# EasyEDA Pro project TPS54331_Neko_BEC.eprj

# Schematic TPS54331_EVA_Board
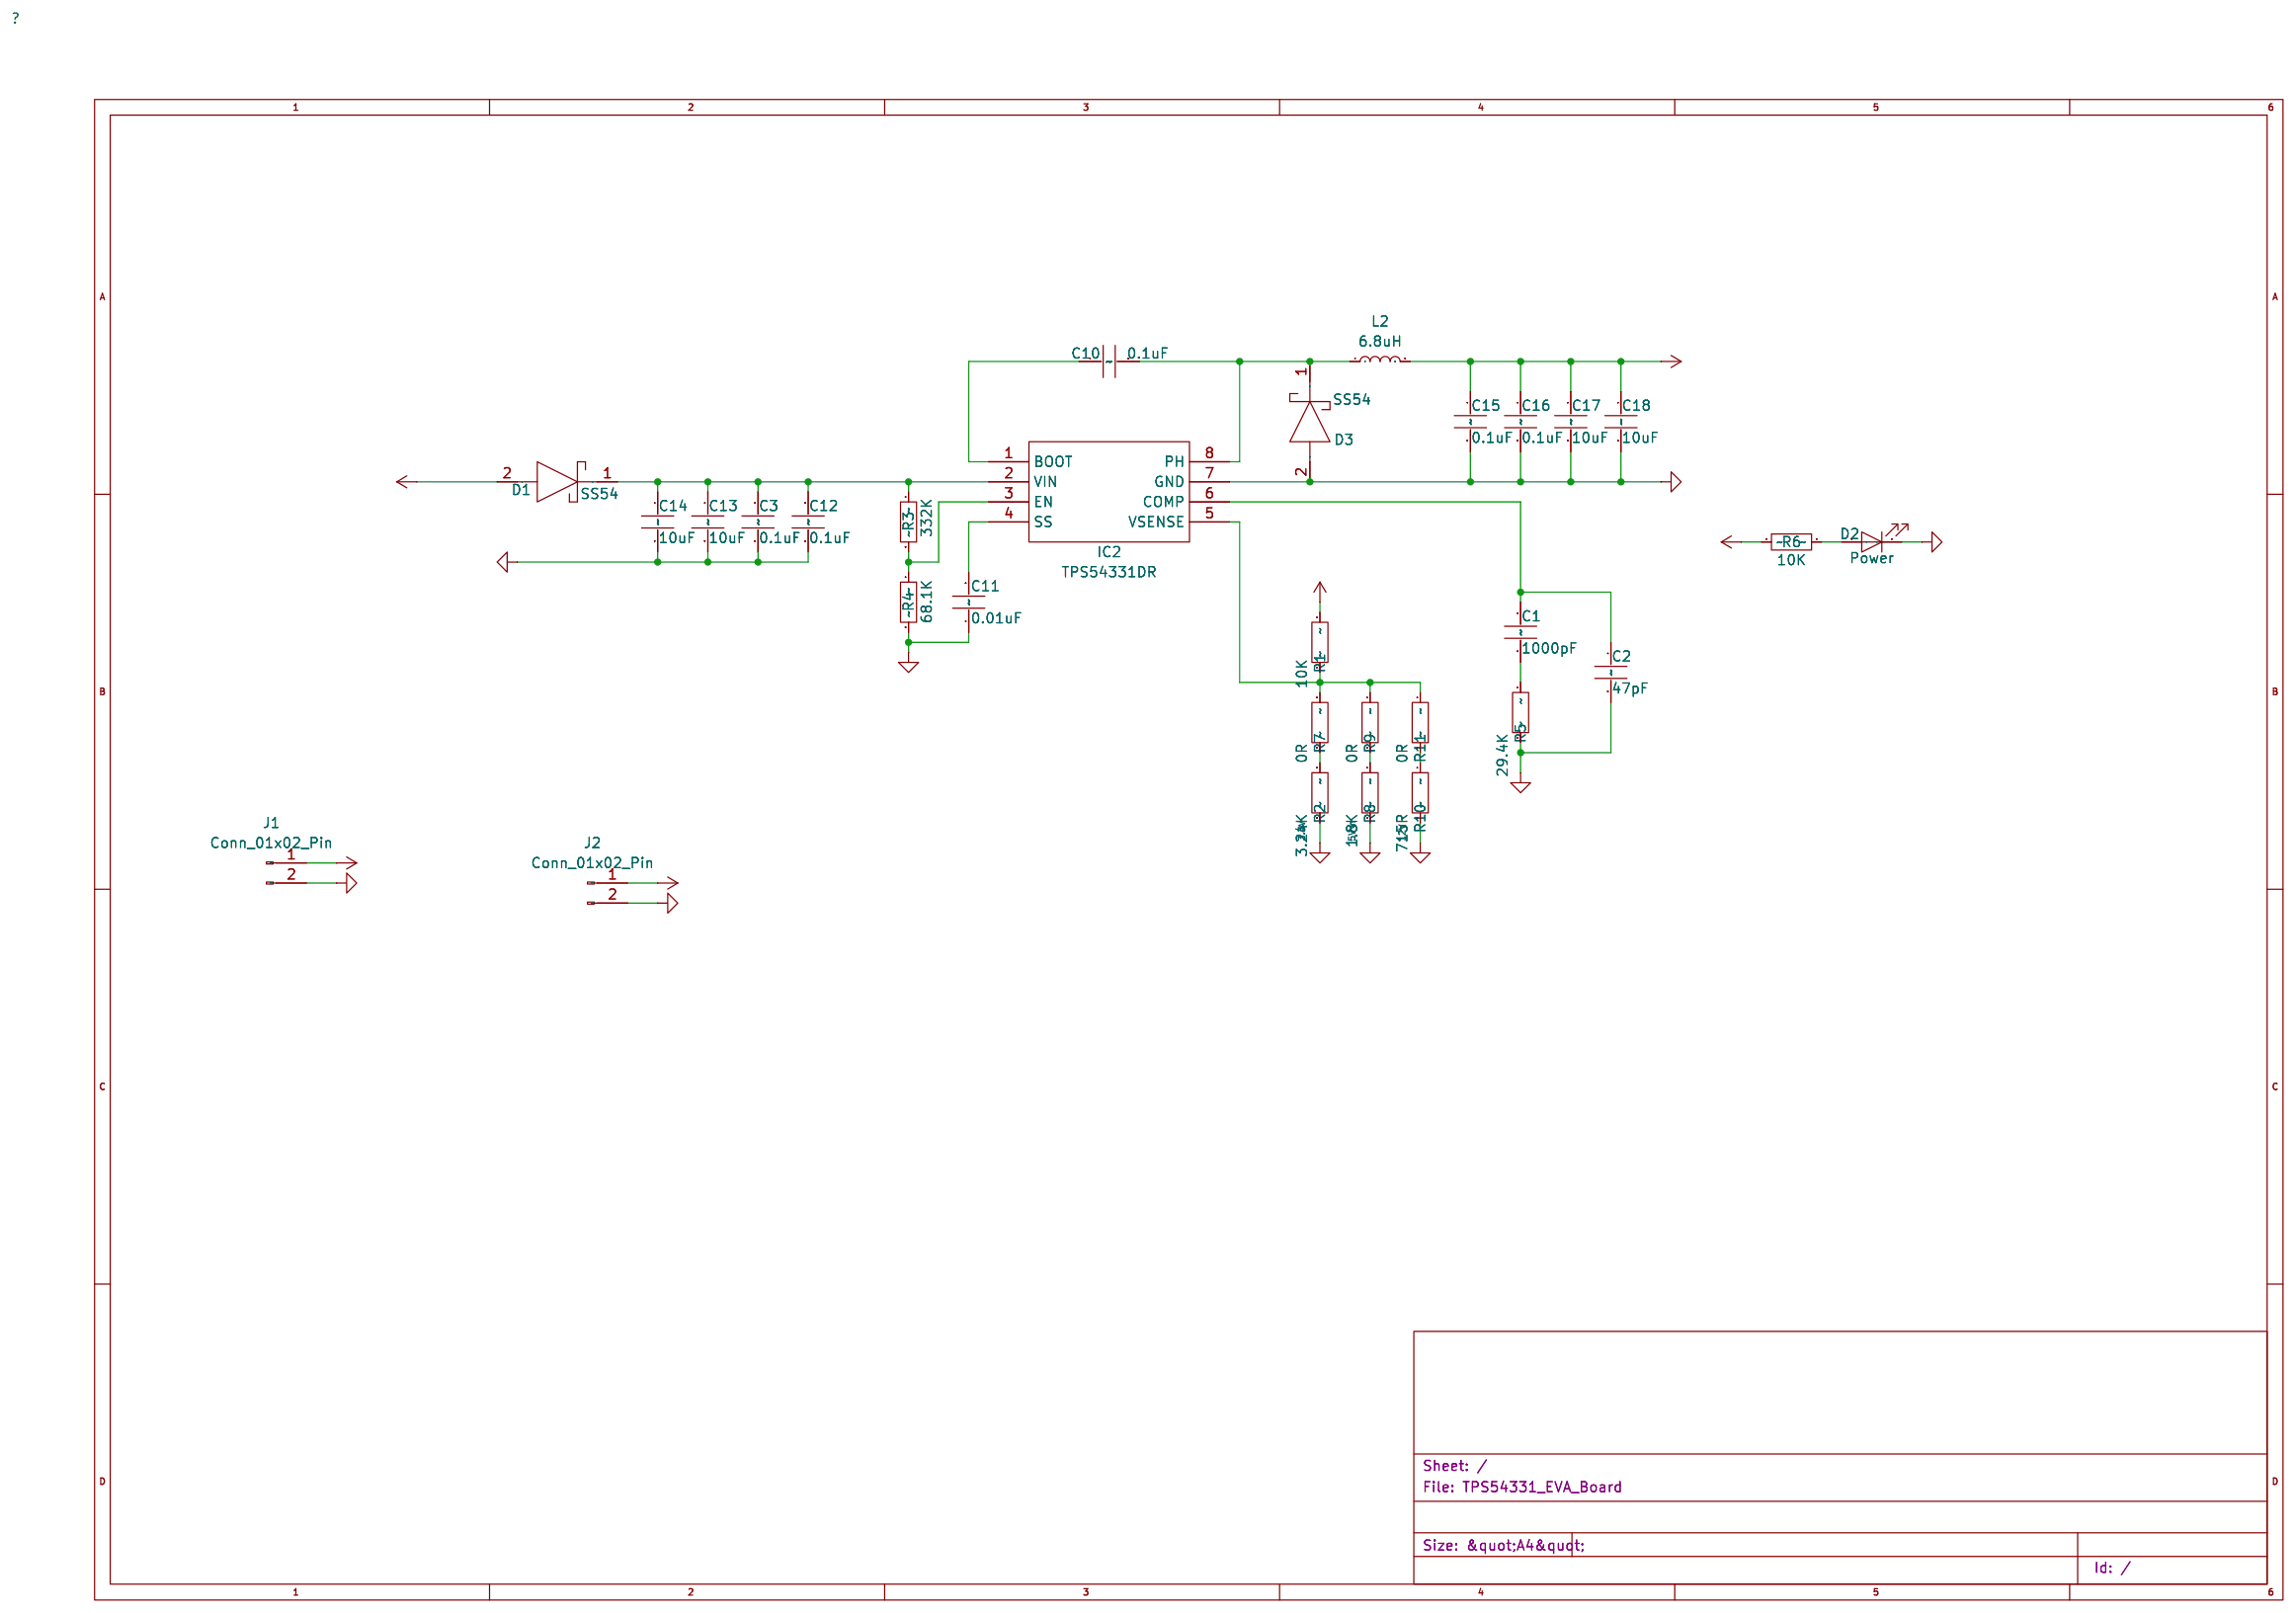
[diagram p0: schematic sheet]

## Parts
C1  1000pF  [Capacitor_SMD:C_0603_1608Metric]
C2  47pF  [Capacitor_SMD:C_0603_1608Metric]
C3  0.1uF  [Capacitor_SMD:C_1206_3216Metric]
C10  0.1uF  [Capacitor_SMD:C_0603_1608Metric]
C11  0.01uF  [Capacitor_SMD:C_0603_1608Metric]
C12  0.1uF  [Capacitor_SMD:C_1206_3216Metric]
C13  10uF  [Capacitor_SMD:C_1206_3216Metric]
C14  10uF  [Capacitor_SMD:C_1206_3216Metric]
C15  0.1uF  [Capacitor_SMD:C_1206_3216Metric]
C16  0.1uF  [Capacitor_SMD:C_1206_3216Metric]
C17  10uF  [Capacitor_SMD:C_1206_3216Metric]
C18  10uF  [Capacitor_SMD:C_1206_3216Metric]
D1  SS54  [SamacSys_Parts:DIOM5126X245N]
D2  Power  [LED_SMD:LED_0603_1608Metric]
D3  SS54  [SamacSys_Parts:DIOM5126X245N]
IC2  TPS54331DR  [SamacSys_Parts:SOIC127P600X175-8N]
J1  Conn_01x02_Pin  [SamacSys_Parts:Power_PAD]
J2  Conn_01x02_Pin  [SamacSys_Parts:Power_PAD]
L2  6.8uH  [Inductor_SMD:L_Changjiang_FNR5040S]
R1  10K  [Resistor_SMD:R_0603_1608Metric]
R2  3.24K  [Resistor_SMD:R_0603_1608Metric]
R3  332K  [Resistor_SMD:R_0603_1608Metric]
R4  68.1K  [Resistor_SMD:R_0603_1608Metric]
R5  29.4K  [Resistor_SMD:R_0603_1608Metric]
R6  10K  [Resistor_SMD:R_0603_1608Metric]
R7  0R  [Resistor_SMD:R_0603_1608Metric]
R8  1.8K  [Resistor_SMD:R_0603_1608Metric]
R9  0R  [Resistor_SMD:R_0603_1608Metric]
R10  715R  [Resistor_SMD:R_0603_1608Metric]
R11  0R  [Resistor_SMD:R_0603_1608Metric]

## Library data of the parts
C1-C3 C10-C18 = Device_C: Unpolarized capacitor
D1 D3 = SamacSys_Parts_SS54: 40V 550mV@5A 5A SMA(DO-214AC) Schottky Barrier Diodes (SBD); User doc link: https://datasheet.lcsc.com/lcsc/2111080930_LGE-SS54_C2903855.pdf; Height: 2.45; Manufacturer_Name: LGE
D2 = Device_LED: Light emitting diode
IC2 = SamacSys_Parts_TPS54331DR: Texas Instruments TPS54331DR, Step Down DC-DC Converter, 3A, Adjustable, 0.8  25 V, 8-Pin SOIC; User doc link: http://www.ti.com/lit/gpn/tps54331; Height: 1.75; Manufacturer_Name: Texas Instruments; Mouser Part Number: 595-TPS54331DR; Mouser Price/Stock: https://www.mouser.co.uk/ProductDetail/Texas-Instruments/TPS54331DR?qs=QyYHynRG50rsSYcB%2Ftz4Yw%3D%3D; Arrow Price/Stock: https://www.arrow.com/en/products/tps54331dr/texas-instruments?region=nac
J1 J2 = Connector_Conn_01x02_Pin: Generic connector, single row, 01x02, script generated
L2 = Device_L: Inductor
R1-R11 = Device_R: Resistor

## Nets
POWER_+5V: C15.1 C16.1 C17.1 C18.1 J2.1(Pin) L2.2 R1.1 R6.1
POWER_GND: C2.2 C3.2 C11.1 C12.2 C13.2 C14.2 C15.2 C16.2 C17.2 C18.2 D2.1(K) D3.2(A) IC2.7(GND) J1.2(Pin) J2.2(Pin) R2.2 R4.2 R5.2 R8.2 R10.2
POWER_VCC: D1.2(A) J1.1(Pin)
NET-(C1-PAD2): C1.2 R5.1
NET-(D1-K): C3.1 C12.1 C13.1 C14.1 D1.1(K) IC2.2(VIN) R3.1
NET-(D2-A): D2.2(A) R6.2
NET-(D3-K): C10.2 D3.1(K) IC2.8(PH) L2.1
NET-(IC2-BOOT): C10.1 IC2.1(BOOT)
NET-(IC2-COMP): C1.1 C2.1 IC2.6(COMP)
NET-(IC2-EN): IC2.3(EN) R3.2 R4.1
NET-(IC2-SS): C11.2 IC2.4(SS)
NET-(IC2-VSENSE): IC2.5(VSENSE) R1.2 R7.1 R9.1 R11.1
NET-(R2-PAD1): R2.1 R7.2
NET-(R8-PAD1): R8.1 R9.2
NET-(R10-PAD1): R10.1 R11.2

## Notes on the sheet
- 3.3V
- 5V\n
- 12V

# Board TPS54331_EVA_Board
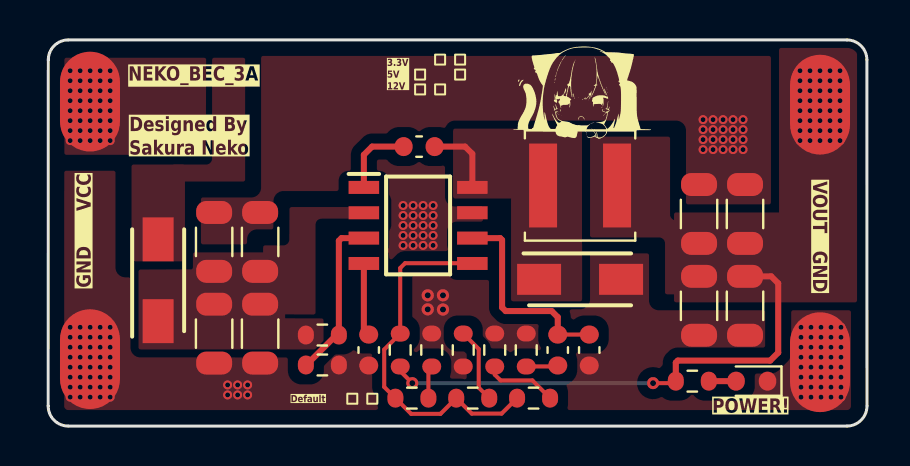
[diagram p1: board, top side]
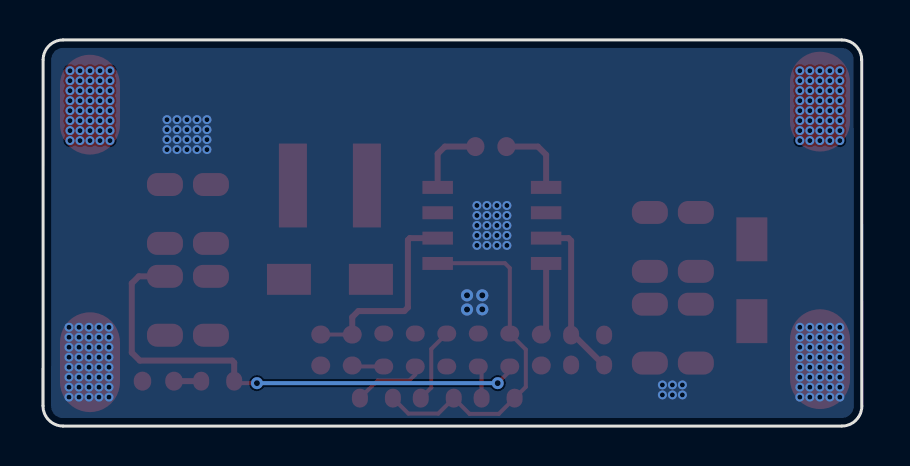
[diagram p2: board, bottom side, seen from below]

Outline 40.95 x 19.34 mm; copper layers: Top Layer, Bottom Layer. Coordinates in mm from the lower left corner of the outline.
Outline path: 0,1.01 0.01,18.34 arc(0.3,19.05) 1.01,19.34 39.94,19.34 arc(40.65,19.05) 40.94,18.34 40.95,1.01 arc(40.65,0.3) 39.94,0 1.01,0 arc(0.29,0.3) 0,1.01
Stack: Top Layer 0.035mm / Dielectric1 1.51mm FR4 er 4.5 / Bottom Layer 0.035mm

## Design rules (mm)
template: 用户自定义配置
spacing safeClearance (default): track to track 0, other pairs 0 to 0.5
track width trackWidth (default): min 0.127, default 0.254, max 2.54
differential pair differentialPair (default): width min 0.127, default 0.254, max 2.54; gap min 0.152, default 0.152
via viaSize (default): diameter min 0.5, default 0.61, max 10; hole min 0.3, default 0.305, max 5.999
net +5V uses CopperRegion4
net Net-(D1-K) uses CopperRegion2
net VCC uses CopperRegion8
net Net-(D3-K) uses CopperRegion6
net GND uses CopperRegion10
pour ie586 uses CopperRegion9
pour ie587 uses CopperRegion9
pour ie588 uses CopperRegion9
pour ie589 uses CopperRegion9
pour ie590 uses CopperRegion9
pour ie591 uses CopperRegion9
pour ie592 uses CopperRegion9
pour ie593 uses CopperRegion9
pour ie595 uses CopperRegion9

## Placement (name value [footprint] x y rotation side)
C1  1000pF  [Capacitor_SMD:C_0603_1608Metric]  25.48 3.81 270 top
C2  47pF  [Capacitor_SMD:C_0603_1608Metric]  27.06 3.81 270 top
C3  0.1uF  [Capacitor_SMD:C_1206_3216Metric]  10.6 9.22 90 top
C10  0.1uF  [Capacitor_SMD:C_0603_1608Metric]  18.55 14 0 top
C11  0.01uF  [Capacitor_SMD:C_0603_1608Metric]  16.03 3.81 90 top
C12  0.1uF  [Capacitor_SMD:C_1206_3216Metric]  10.6 4.63 270 top
C13  10uF  [Capacitor_SMD:C_1206_3216Metric]  8.3 9.22 90 top
C14  10uF  [Capacitor_SMD:C_1206_3216Metric]  8.3 4.63 270 top
C15  0.1uF  [Capacitor_SMD:C_1206_3216Metric]  32.55 6.02 270 top
C16  0.1uF  [Capacitor_SMD:C_1206_3216Metric]  32.55 10.62 90 top
C17  10uF  [Capacitor_SMD:C_1206_3216Metric]  34.85 6.02 270 top
C18  10uF  [Capacitor_SMD:C_1206_3216Metric]  34.85 10.62 90 top
D1  SS54  [SamacSys_Parts:DIOM5126X245N]  5.5 7.3 90 top
D2  Power  [LED_SMD:LED_0603_1608Metric]  35.19 2.25 180 top
D3  SS54  [SamacSys_Parts:DIOM5126X245N]  26.6 7.35 0 top
G***  LOGO  [SamacSys_Parts:nya]  26.71 16.81 0 top
IC2  TPS54331DR  [SamacSys_Parts:SOIC127P600X175-8N]  18.5 10.05 0 top
J1  Conn_01x02_Pin  [SamacSys_Parts:Power_PAD]  2.09 9.85 270 top
J2  Conn_01x02_Pin  [SamacSys_Parts:Power_PAD]  38.6 9.7 270 top
L2  6.8uH  [Inductor_SMD:L_Changjiang_FNR5040S]  26.6 12.05 0 top
R1  10K  [Resistor_SMD:R_0603_1608Metric]  17.61 3.81 90 top
R2  3.24K  [Resistor_SMD:R_0603_1608Metric]  19.18 3.81 90 top
R3  332K  [Resistor_SMD:R_0603_1608Metric]  13.71 4.56 0 top
R4  68.1K  [Resistor_SMD:R_0603_1608Metric]  13.71 3.06 0 top
R5  29.4K  [Resistor_SMD:R_0603_1608Metric]  23.91 3.81 90 top
R6  10K  [Resistor_SMD:R_0603_1608Metric]  32.21 2.25 0 top
R7  0R  [Resistor_SMD:R_0603_1608Metric]  18.19 1.4 0 top
R8  1.8K  [Resistor_SMD:R_0603_1608Metric]  20.76 3.81 270 top
R9  0R  [Resistor_SMD:R_0603_1608Metric]  21.23 1.4 0 top
R10  715R  [Resistor_SMD:R_0603_1608Metric]  22.33 3.81 90 top
R11  0R  [Resistor_SMD:R_0603_1608Metric]  24.28 1.4 0 top

## Footprints (pads in the part's own frame, mm; a bottom-side part is the same pattern mirrored in y, then rotated)
Capacitor_SMD:C_0603_1608Metric
  rrect 0.9x0.95 smd: 1(-0.775,0) 2(0.775,0)
Capacitor_SMD:C_1206_3216Metric
  rrect 1.15x1.8 smd: 1(-1.475,0) 2(1.475,0)
Inductor_SMD:L_Changjiang_FNR5040S
  rect 1.4x4.2 smd: 1(-1.85,0) 2(1.85,0)
LED_SMD:LED_0603_1608Metric
  rrect 0.875x0.95 smd: 1(-0.787,0) 2(0.787,0)
Resistor_SMD:R_0603_1608Metric
  rrect 0.8x0.95 smd: 1(-0.825,0) 2(0.825,0)
SamacSys_Parts:DIOM5126X245N
  rect 2.2x1.55 smd: 1(-2.05,0) 2(2.05,0)
SamacSys_Parts:Power_PAD
  rrect 5x3 smd: 1(-6.4,0) 2(6.5,0)
SamacSys_Parts:SOIC127P600X175-8N
  rect 1.525x0.65 smd: 1(-2.712,1.905) 2(-2.712,0.635) 3(-2.712,-0.635) 4(-2.712,-1.905) 5(2.712,-1.905) 6(2.712,-0.635) 7(2.712,0.635) 8(2.712,1.905)

## Nets
As in the schematic, except:
+5V: C15.1 C16.1 C17.1 C18.1 J2.1 L2.2 R1.1 R6.1
GND: C2.2 C3.2 C11.1 C12.2 C13.2 C14.2 C15.2 C16.2 C17.2 C18.2 D2.1 D3.2 IC2.7 J1.2 J2.2 R2.2 R4.2 R5.2 R8.2 R10.2
VCC: D1.2 J1.1

## Via types
v1: diameter 0.45, hole 0.25, Top Layer to Bottom Layer, 206 vias
v2: diameter 0.6, hole 0.3, Top Layer to Bottom Layer, 2 vias
v3: diameter 0.61, hole 0.305, Top Layer to Bottom Layer, 4 vias

## Routing (per net, layer and track width the routed paths; a pad name or vN(x,y) marks a point on that pad's centre or on a via; arc(x,y) is an arc through that point)
+5V: length 26.2
  Top Layer w0.2: R6.1 31.29,2.15 v2(30.25,2.15) ; 17.37,2.74 R1.1 17.61,2.75 v2(18.21,2.15)
  Top Layer w0.3: R6.1 31.39,3.18 31.49,3.28 36.11,3.28 36.51,3.68 36.51,7.15 36.16,7.5 C17.1
  Bottom Layer w0.2: v2(18.21,2.15) v2(30.25,2.15)
  vias: v1(37.6,17.8) v1(37.6,17.3) v1(37.6,16.8) v1(37.6,16.3) v1(37.6,15.8) v1(37.6,15.3) v1(37.6,14.8) v1(37.6,14.3) v1(38.1,17.8) v1(38.1,17.3) v1(38.1,16.8) v1(38.1,16.3) v1(38.1,15.8) v1(38.1,15.3) v1(38.1,14.8) v1(38.1,14.3) v1(38.6,17.8) v1(38.6,17.3) v1(38.6,16.8) v1(38.6,16.3) v1(38.6,15.8) v1(38.6,15.3) v1(38.6,14.8) v1(38.6,14.3) v1(39.1,17.8) v1(39.1,17.3) v1(39.1,16.8) v1(39.1,16.3) v1(39.1,15.8) v1(39.1,15.3) v1(39.1,14.8) v1(39.1,14.3) v1(39.6,17.8) v1(39.6,17.3) v1(39.6,16.8) v1(39.6,16.3) v1(39.6,15.8) v1(39.6,15.3) v1(39.6,14.8) v1(39.6,14.3)
GND:
  vias: v1(1.1,4.95) v1(1.1,4.45) v1(1.1,3.95) v1(1.1,3.45) v1(1.1,2.95) v1(1.1,2.45) v1(1.1,1.95) v1(1.1,1.45) v1(1.6,4.95) v1(1.6,4.45) v1(1.6,3.95) v1(1.6,3.45) v1(1.6,2.95) v1(1.6,2.45) v1(1.6,1.95) v1(1.6,1.45) v1(2.1,4.95) v1(2.1,4.45) v1(2.1,3.95) v1(2.1,3.45) v1(2.1,2.95) v1(2.1,2.45) v1(2.1,1.95) v1(2.1,1.45) v1(2.6,4.95) v1(2.6,4.45) v1(2.6,3.95) v1(2.6,3.45) v1(2.6,2.95) v1(2.6,2.45) v1(2.6,1.95) v1(2.6,1.45) v1(3.1,4.95) v1(3.1,4.45) v1(3.1,3.95) v1(3.1,3.45) v1(3.1,2.95) v1(3.1,2.45) v1(3.1,1.95) v1(3.1,1.45) v1(8.97,2.06) v1(8.97,1.56) v1(9.47,2.06) v1(9.47,1.56) v1(9.97,2.06) v1(9.97,1.56) v1(17.75,11.05) v1(17.75,10.55) v1(17.75,10.05) v1(17.75,9.55) v1(17.75,9.05) v1(18.25,11.05) v1(18.25,10.55) v1(18.25,10.05) v1(18.25,9.55) v1(18.25,9.05) v1(18.75,11.05) v1(18.75,10.55) v1(18.75,10.05) v1(18.75,9.55) v1(18.75,9.05) v1(19.25,11.05) v1(19.25,10.55) v1(19.25,10.05) v1(19.25,9.55) v1(19.25,9.05) v1(32.75,15.35) v1(32.75,14.85) v1(32.75,14.35) v1(32.75,13.85) v1(33.25,15.35) v1(33.25,14.85) v1(33.25,14.35) v1(33.25,13.85) v1(33.75,15.35) v1(33.75,14.85) v1(33.75,14.35) v1(33.75,13.85) v1(34.25,15.35) v1(34.25,14.85) v1(34.25,14.35) v1(34.25,13.85) v1(34.75,15.35) v1(34.75,14.85) v1(34.75,14.35) v1(34.75,13.85) v1(37.65,4.95) v1(37.65,4.45) v1(37.65,3.95) v1(37.65,3.45) v1(37.65,2.95) v1(37.65,2.45) v1(37.65,1.95) v1(37.65,1.45) v1(38.15,4.95) v1(38.15,4.45) v1(38.15,3.95) v1(38.15,3.45) v1(38.15,2.95) v1(38.15,2.45) v1(38.15,1.95) v1(38.15,1.45) v1(38.65,4.95) v1(38.65,4.45) v1(38.65,3.95) v1(38.65,3.45) v1(38.65,2.95) v1(38.65,2.45) v1(38.65,1.95) v1(38.65,1.45) v1(39.15,4.95) v1(39.15,4.45) v1(39.15,3.95) v1(39.15,3.45) v1(39.15,2.95) v1(39.15,2.45) v1(39.15,1.95) v1(39.15,1.45) v1(39.65,4.95) v1(39.65,4.45) v1(39.65,3.95) v1(39.65,3.45) v1(39.65,2.95) v1(39.65,2.45) v1(39.65,1.95) v1(39.65,1.45) v3(18.98,6.55) v3(18.98,5.85) v3(19.74,6.55) v3(19.74,5.84)
VCC:
  vias: v1(1.1,17.8) v1(1.1,17.3) v1(1.1,16.8) v1(1.1,16.3) v1(1.1,15.8) v1(1.1,15.3) v1(1.1,14.8) v1(1.1,14.3) v1(1.6,17.8) v1(1.6,17.3) v1(1.6,16.8) v1(1.6,16.3) v1(1.6,15.8) v1(1.6,15.3) v1(1.6,14.8) v1(1.6,14.3) v1(2.1,17.8) v1(2.1,17.3) v1(2.1,16.8) v1(2.1,16.3) v1(2.1,15.8) v1(2.1,15.3) v1(2.1,14.8) v1(2.1,14.3) v1(2.6,17.8) v1(2.6,17.3) v1(2.6,16.8) v1(2.6,16.3) v1(2.6,15.8) v1(2.6,15.3) v1(2.6,14.8) v1(2.6,14.3) v1(3.1,17.8) v1(3.1,17.3) v1(3.1,16.8) v1(3.1,16.3) v1(3.1,15.8) v1(3.1,15.3) v1(3.1,14.8) v1(3.1,14.3)
NET-(C1-PAD2): length 1.6
  Top Layer w0.2: 25.48,3.03 25.43,2.98 R5.1
NET-(D2-A): length 1.4
  Top Layer w0.3: R6.2 D2.2
NET-(D3-K): length 3.7
  Top Layer w0.3: 19.32,14 20.85,14 21.21,13.64 IC2.8
NET-(IC2-BOOT): length 3.8
  Top Layer w0.3: C10.1 16.2,14 15.79,13.59 IC2.1
NET-(IC2-COMP): length 10.3
  Top Layer w0.2: C1.1 C2.1
  Top Layer w0.3: IC2.6 22.6,9.41 22.7,9.32 22.7,5.94 22.88,5.76 25.18,5.76 25.48,5.46 C1.1
NET-(IC2-EN): length 8.3
  Top Layer w0.3: IC2.3 14.67,9.41 14.54,9.28 R3.2 14.41,4.56 12.91,3.06 R4.1
NET-(IC2-SS): length 3.7
  Top Layer w0.3: IC2.4 15.79,4.83 C11.2
NET-(IC2-VSENSE): length 18.2
  Top Layer w0.2: R11.1 22.68,0.62 21.18,0.62 R9.1 19.62,0.61 18.16,0.61 R7.1 16.81,1.96 16.81,3.83 R1.2 17.61,7.92 17.85,8.16 21.2,8.16 IC2.5
NET-(R2-PAD1): length 1.7
  Top Layer w0.2: R2.1 19.01,2.82 R7.2
NET-(R8-PAD1): length 3.8
  Top Layer w0.2: R9.2 21.53,1.93 21.53,3.86 R8.1
NET-(R10-PAD1): length 3.7
  Top Layer w0.2: R10.1 22.33,2.58 22.62,2.28 24.22,2.28 R11.2

## Copper pours and planes (outline as drawn; the poured copper is in the pictures)
+5V on Top Layer: 31.4,10.6 31.4,6.3 40.35,6.3 40.35,19.35 36.65,19.35 36.65,10.6
+5V on Top Layer: 26.8,14.8 26.8,9.15 30.55,9.15 30.55,6.3 36,6.3 36,10.6 31.4,10.6 31.4,14.8
GND on Top Layer: -2.23,23.4 42.9,22.9 44.9,-3.25 -7.1,-3
GND on Bottom Layer: -2.74,22.38 42.39,21.88 44.39,-4.27 -7.61,-4.02
VCC on Top Layer: 7.14,7.95 7.14,13.4 3.87,13.4 3.87,7.95
VCC on Top Layer: 8.18,13.29 8.2,18.75 0.35,18.75 0.33,13.29
VCC on Top Layer: 7.9,18.75 7.9,13.4 5.9,13.4 5.9,11.95 10.15,11.95 10.15,18.75
NET-(D1-K) on Top Layer: 16.66,10.1 13.67,10.09 13.67,5.29 10.45,5.3 10.45,9.35 11.76,9.35 11.77,11.27 16.66,11.27
NET-(D1-K) on Top Layer: 4.62,3.94 13.67,3.94 13.67,5.29 11.75,5.3 11.75,8.6 7.26,8.6 7.26,7.75 4.62,7.74
NET-(D3-K) on Top Layer: 20.35,11.5 23.25,11.5 23.25,6.35 26.6,6.35 26.6,14.8 20.35,14.8

## Text on the board
Top Silkscreen Layer: Default | 3.3V / 5V / 12V | NEKO_BEC_3A | Designed By / Sakura Neko | POWER! | GND      VCC | VOUT   GND
